# Altium project 电源转接板.PrjPcb
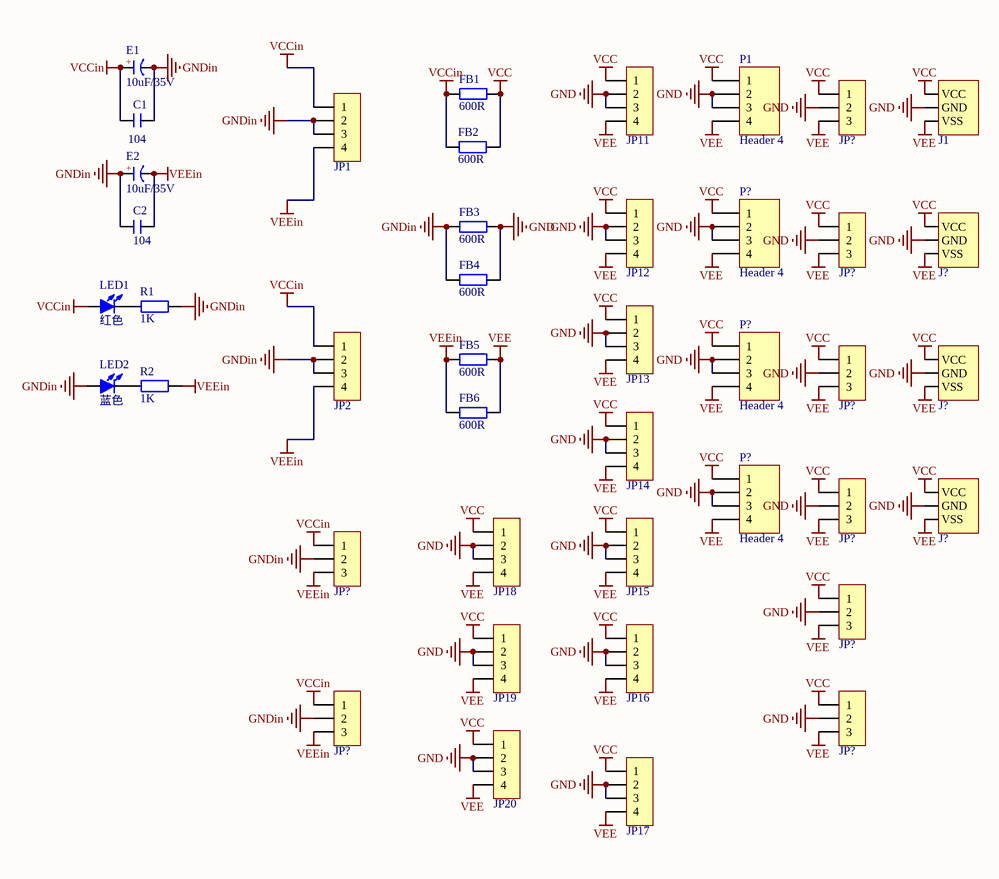
[diagram p0: Sheet1.SchDoc]
1 sheet, 42 parts. Net scope: global (net labels, ports and power ports of the same name join across sheets).
Board files: PCB1.PcbDoc, PCB2.PcbDoc

## Sheet Sheet1.SchDoc
size A4

### Parts
(Parts that share a designator on the sheet are numbered #1, #2 ... from top to bottom, then left to right.)
C1  104  [C 0805_L]
C2  104  [C 0805_L]
E1  10uF/35V  [CAP 5.0*10*12.5]
E2  10uF/35V  [CAP 5.0*10*16]
FB1  600R  [FB-0805]
FB2  600R  [FB-0805]
FB3  600R  [FB-0805]
FB4  600R  [FB-0805]
FB5  600R  [FB-0805]
FB6  600R  [FB-0805]
J1  接线座-3P  [KF128-5.08-3P]  (value not drawn)
J?#1  接线座-3P  [KF128-5.08-3P]  (value not drawn)
J?#2  接线座-3P  [KF128-5.08-3P]  (value not drawn)
J?#3  接线座-3P  [KF128-5.08-3P]  (value not drawn)
JP1  HDR-1X4  [VH3.96-LI-4P]  (value not drawn)
JP2  HDR-1X4  [VH3.96-LI-4P]  (value not drawn)
JP11  HDR-1X4  [VH3.96-LI-4P]  (value not drawn)
JP12  HDR-1X4  [VH3.96-LI-4P]  (value not drawn)
JP13  HDR-1X4  [VH3.96-LI-4P]  (value not drawn)
JP14  HDR-1X4  [VH3.96-LI-4P]  (value not drawn)
JP15  HDR-1X4  [VH3.96-LI-4P]  (value not drawn)
JP16  HDR-1X4  [VH3.96-LI-4P]  (value not drawn)
JP17  HDR-1X4  [VH3.96-LI-4P]  (value not drawn)
JP18  HDR-1X4  [VH3.96-LI-4P]  (value not drawn)
JP19  HDR-1X4  [VH3.96-LI-4P]  (value not drawn)
JP20  HDR-1X4  [VH3.96-LI-4P]  (value not drawn)
JP?#1  HDR-1X3  [XH2.54-LI-3P]  (value not drawn)
JP?#2  HDR-1X3  [XH2.54-LI-3P]  (value not drawn)
JP?#3  HDR-1X3  [XH2.54-LI-3P]  (value not drawn)
JP?#4  HDR-1X3  [XH2.54-LI-3P]  (value not drawn)
JP?#5  HDR-1X3  [XH2.54-LI-3P]  (value not drawn)
JP?#6  HDR-1X3  [XH2.54-LI-3P]  (value not drawn)
JP?#7  HDR-1X3  [XH2.54-LI-3P]  (value not drawn)
JP?#8  HDR-1X3  [XH2.54-LI-3P]  (value not drawn)
LED1  红色  [LED 0805G]
LED2  蓝色  [LED 0805G]
P1  Header 4  [HDR1X4]
P?#1  Header 4  [HDR1X4]
P?#2  Header 4  [HDR1X4]
P?#3  Header 4  [HDR1X4]
R1  1K  [R 0603_L]
R2  1K  [R 0603_L]

### Nets
GND: FB3.2 FB4.2 J1.2(GND) J?#1.2(GND) J?#2.2(GND) J?#3.2(GND) JP11.2 JP11.3 JP12.2 JP12.3 JP13.2 JP13.3 JP14.2 JP14.3 JP15.2 JP15.3 JP16.2 JP16.3 JP17.2 JP17.3 JP18.2 JP18.3 JP19.2 JP19.3 JP20.2 JP20.3 JP?#1.2 JP?#2.2 JP?#3.2 JP?#4.2 JP?#6.2 JP?#8.2 P1.2 P1.3 P?#1.2 P?#1.3 P?#2.2 P?#2.3 P?#3.2 P?#3.3
GNDin: C1.2 C2.1 E1.2(K) E2.1(A) FB3.1 FB4.1 JP1.2 JP1.3 JP2.2 JP2.3 JP?#5.2 JP?#7.2 LED2.1(A) R1.2
VCC: FB1.2 FB2.2 J1.1(VCC) J?#1.1(VCC) J?#2.1(VCC) J?#3.1(VCC) JP11.1 JP12.1 JP13.1 JP14.1 JP15.1 JP16.1 JP17.1 JP18.1 JP19.1 JP20.1 JP?#1.1 JP?#2.1 JP?#3.1 JP?#4.1 JP?#6.1 JP?#8.1 P1.1 P?#1.1 P?#2.1 P?#3.1
VCCin: C1.1 E1.1(A) FB1.1 FB2.1 JP1.1 JP2.1 JP?#5.1 JP?#7.1 LED1.1(A)
VEE: FB5.2 FB6.2 J1.3(VSS) J?#1.3(VSS) J?#2.3(VSS) J?#3.3(VSS) JP11.4 JP12.4 JP13.4 JP14.4 JP15.4 JP16.4 JP17.4 JP18.4 JP19.4 JP20.4 JP?#1.3 JP?#2.3 JP?#3.3 JP?#4.3 JP?#6.3 JP?#8.3 P1.4 P?#1.4 P?#2.4 P?#3.4
VEEin: C2.2 E2.2(K) FB5.1 FB6.1 JP1.4 JP2.4 JP?#5.3 JP?#7.3 R2.2
NetLED1_2: LED1.2(K) R1.1
NetLED2_2: LED2.2(K) R2.1

### Notes on the sheet
- (in symbol C-CAP) +

### Library data of the parts
C1 C2 = C: 无极性贴片电容; 版权归属: 源创客; BOM名称: 无极性贴片电容; 学习资源: www.ooocke.com
E1 E2 = C-CAP: 直插电解电容; 版权归属: 源创客; BOM名称: 直插电解电容; 学习资源: www.ooocke.com
FB1-FB6 = FB
JP1 JP2 JP11-JP20 = Header 4: 4P接插件; 版权归属: 源创客; BOM名称: 4P接插件; 学习资源: www.ooocke.com
JP?#1-JP?#8 = Header 3: 3P接插件; 版权归属: 源创客; BOM名称: 3P接插件; 学习资源: www.ooocke.com
LED1 LED2 = LED-SMD: 贴片LED; 版权归属: 源创客; BOM名称: 贴片LED; 学习资源: www.ooocke.com
P1 P?#1-P?#3 = Header 4: Header, 4-Pin; LatestRevisionDate: 17-Jul-2002; LatestRevisionNote: Re-released for DXP Platform.; Publisher: Altium Limited
R1 R2 = R: 贴片电阻; 版权归属: 源创客; BOM名称: 贴片电阻; 学习资源: www.ooocke.com